# Altium schematic sheet FPGA_IO.SchDoc
size B
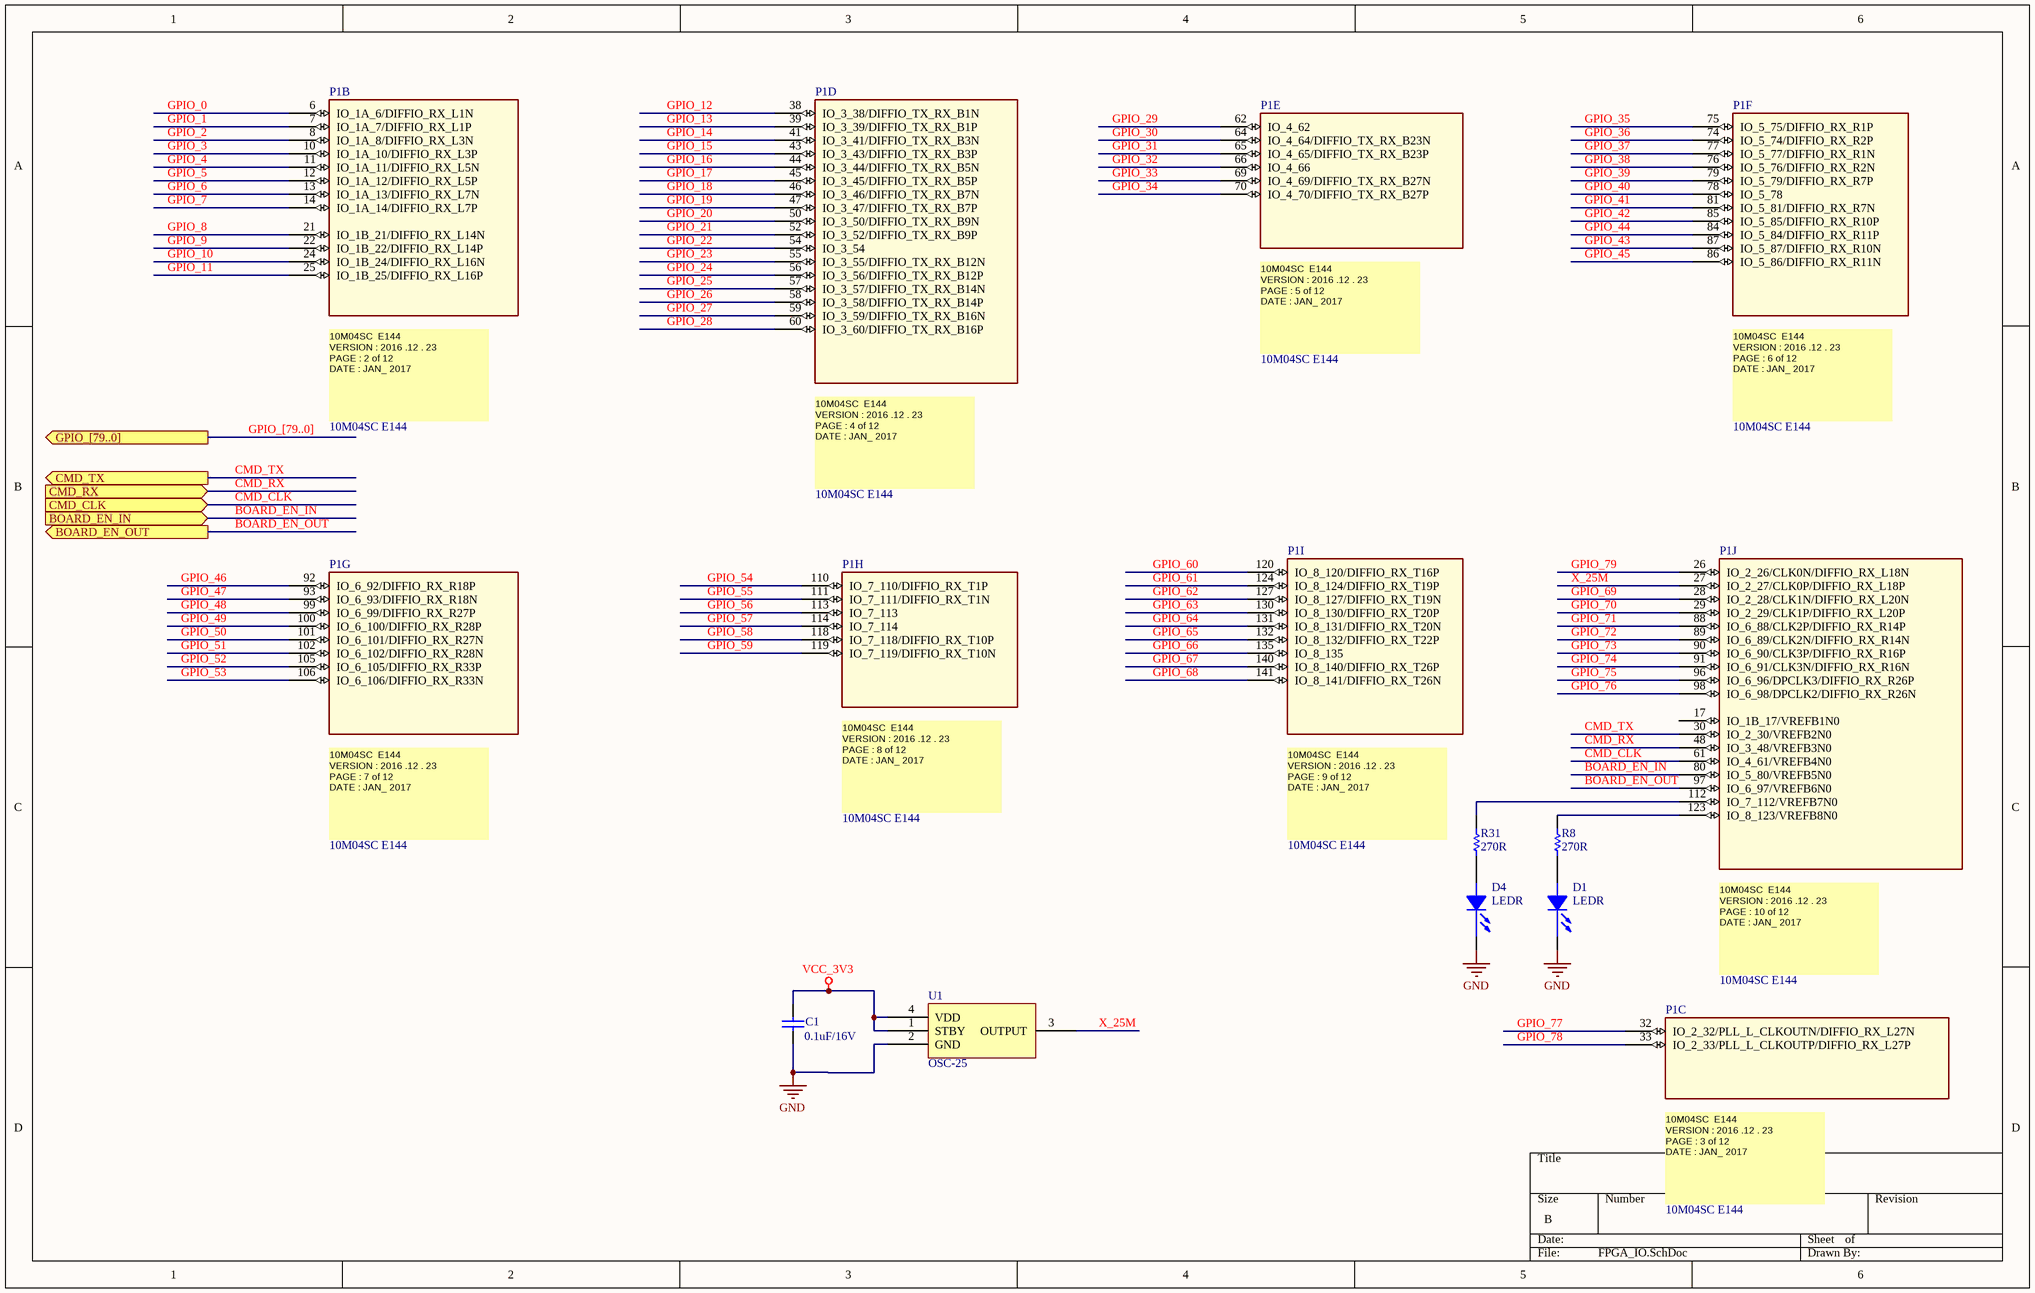
[diagram p0: FPGA_IO.SchDoc]

## Parts
C1  0.1uF/16V  [0402_CAP]
D1  LEDR  [LED0603]
D4  LEDR  [LED0603]
P1  10M04SC E144  (parts B,C,D,E,F,G,H,I,J of 12)
R8  270R  [AXIAL-0.3]
R31  270R  [AXIAL-0.3]
U1  OSC-25  [ASE-25.000MHZ-LC-T]

## Ports
BOARD_EN_IN (in), BOARD_EN_OUT (out), CMD_CLK (in), CMD_RX (in), CMD_TX (out), GPIO_[79..0] (out)

## Nets
GND: C1.1 D1.2(CATHODE) D4.2(CATHODE) U1.2(GND)
VCC_3V3: C1.2 U1.1(STBY) U1.4(VDD)
BOARD_EN_IN: P1.80(IO_5_80/VREFB5N0) ; port BOARD_EN_IN
BOARD_EN_OUT: P1.97(IO_6_97/VREFB6N0) ; port BOARD_EN_OUT
CMD_CLK: P1.61(IO_4_61/VREFB4N0) ; port CMD_CLK
CMD_RX: P1.48(IO_3_48/VREFB3N0) ; port CMD_RX
CMD_TX: P1.30(IO_2_30/VREFB2N0) ; port CMD_TX
GPIO_0: P1.6(IO_1A_6/DIFFIO_RX_L1N)
GPIO_1: P1.7(IO_1A_7/DIFFIO_RX_L1P)
GPIO_2: P1.8(IO_1A_8/DIFFIO_RX_L3N)
GPIO_3: P1.10(IO_1A_10/DIFFIO_RX_L3P)
GPIO_4: P1.11(IO_1A_11/DIFFIO_RX_L5N)
GPIO_5: P1.12(IO_1A_12/DIFFIO_RX_L5P)
GPIO_6: P1.13(IO_1A_13/DIFFIO_RX_L7N)
GPIO_7: P1.14(IO_1A_14/DIFFIO_RX_L7P)
GPIO_8: P1.21(IO_1B_21/DIFFIO_RX_L14N)
GPIO_9: P1.22(IO_1B_22/DIFFIO_RX_L14P)
GPIO_10: P1.24(IO_1B_24/DIFFIO_RX_L16N)
GPIO_11: P1.25(IO_1B_25/DIFFIO_RX_L16P)
GPIO_12: P1.38(IO_3_38/DIFFIO_TX_RX_B1N)
GPIO_13: P1.39(IO_3_39/DIFFIO_TX_RX_B1P)
GPIO_14: P1.41(IO_3_41/DIFFIO_TX_RX_B3N)
GPIO_15: P1.43(IO_3_43/DIFFIO_TX_RX_B3P)
GPIO_16: P1.44(IO_3_44/DIFFIO_TX_RX_B5N)
GPIO_17: P1.45(IO_3_45/DIFFIO_TX_RX_B5P)
GPIO_18: P1.46(IO_3_46/DIFFIO_TX_RX_B7N)
GPIO_19: P1.47(IO_3_47/DIFFIO_TX_RX_B7P)
GPIO_20: P1.50(IO_3_50/DIFFIO_TX_RX_B9N)
GPIO_21: P1.52(IO_3_52/DIFFIO_TX_RX_B9P)
GPIO_22: P1.54(IO_3_54)
GPIO_23: P1.55(IO_3_55/DIFFIO_TX_RX_B12N)
GPIO_24: P1.56(IO_3_56/DIFFIO_TX_RX_B12P)
GPIO_25: P1.57(IO_3_57/DIFFIO_TX_RX_B14N)
GPIO_26: P1.58(IO_3_58/DIFFIO_TX_RX_B14P)
GPIO_27: P1.59(IO_3_59/DIFFIO_TX_RX_B16N)
GPIO_28: P1.60(IO_3_60/DIFFIO_TX_RX_B16P)
GPIO_29: P1.62(IO_4_62)
GPIO_30: P1.64(IO_4_64/DIFFIO_TX_RX_B23N)
GPIO_31: P1.65(IO_4_65/DIFFIO_TX_RX_B23P)
GPIO_32: P1.66(IO_4_66)
GPIO_33: P1.69(IO_4_69/DIFFIO_TX_RX_B27N)
GPIO_34: P1.70(IO_4_70/DIFFIO_TX_RX_B27P)
GPIO_35: P1.75(IO_5_75/DIFFIO_RX_R1P)
GPIO_36: P1.74(IO_5_74/DIFFIO_RX_R2P)
GPIO_37: P1.77(IO_5_77/DIFFIO_RX_R1N)
GPIO_38: P1.76(IO_5_76/DIFFIO_RX_R2N)
GPIO_39: P1.79(IO_5_79/DIFFIO_RX_R7P)
GPIO_40: P1.78(IO_5_78)
GPIO_41: P1.81(IO_5_81/DIFFIO_RX_R7N)
GPIO_42: P1.85(IO_5_85/DIFFIO_RX_R10P)
GPIO_43: P1.87(IO_5_87/DIFFIO_RX_R10N)
GPIO_44: P1.84(IO_5_84/DIFFIO_RX_R11P)
GPIO_45: P1.86(IO_5_86/DIFFIO_RX_R11N)
GPIO_46: P1.92(IO_6_92/DIFFIO_RX_R18P)
GPIO_47: P1.93(IO_6_93/DIFFIO_RX_R18N)
GPIO_48: P1.99(IO_6_99/DIFFIO_RX_R27P)
GPIO_49: P1.100(IO_6_100/DIFFIO_RX_R28P)
GPIO_50: P1.101(IO_6_101/DIFFIO_RX_R27N)
GPIO_51: P1.102(IO_6_102/DIFFIO_RX_R28N)
GPIO_52: P1.105(IO_6_105/DIFFIO_RX_R33P)
GPIO_53: P1.106(IO_6_106/DIFFIO_RX_R33N)
GPIO_54: P1.110(IO_7_110/DIFFIO_RX_T1P)
GPIO_55: P1.111(IO_7_111/DIFFIO_RX_T1N)
GPIO_56: P1.113(IO_7_113)
GPIO_57: P1.114(IO_7_114)
GPIO_58: P1.118(IO_7_118/DIFFIO_RX_T10P)
GPIO_59: P1.119(IO_7_119/DIFFIO_RX_T10N)
GPIO_60: P1.120(IO_8_120/DIFFIO_RX_T16P)
GPIO_61: P1.124(IO_8_124/DIFFIO_RX_T19P)
GPIO_62: P1.127(IO_8_127/DIFFIO_RX_T19N)
GPIO_63: P1.130(IO_8_130/DIFFIO_RX_T20P)
GPIO_64: P1.131(IO_8_131/DIFFIO_RX_T20N)
GPIO_65: P1.132(IO_8_132/DIFFIO_RX_T22P)
GPIO_66: P1.135(IO_8_135)
GPIO_67: P1.140(IO_8_140/DIFFIO_RX_T26P)
GPIO_68: P1.141(IO_8_141/DIFFIO_RX_T26N)
GPIO_69: P1.28(IO_2_28/CLK1N/DIFFIO_RX_L20N)
GPIO_70: P1.29(IO_2_29/CLK1P/DIFFIO_RX_L20P)
GPIO_71: P1.88(IO_6_88/CLK2P/DIFFIO_RX_R14P)
GPIO_72: P1.89(IO_6_89/CLK2N/DIFFIO_RX_R14N)
GPIO_73: P1.90(IO_6_90/CLK3P/DIFFIO_RX_R16P)
GPIO_74: P1.91(IO_6_91/CLK3N/DIFFIO_RX_R16N)
GPIO_75: P1.96(IO_6_96/DPCLK3/DIFFIO_RX_R26P)
GPIO_76: P1.98(IO_6_98/DPCLK2/DIFFIO_RX_R26N)
GPIO_77: P1.32(IO_2_32/PLL_L_CLKOUTN/DIFFIO_RX_L27N)
GPIO_78: P1.33(IO_2_33/PLL_L_CLKOUTP/DIFFIO_RX_L27P)
GPIO_79: P1.26(IO_2_26/CLK0N/DIFFIO_RX_L18N)
X_25M: P1.27(IO_2_27/CLK0P/DIFFIO_RX_L18P) U1.3(OUTPUT)
NetD1_1: D1.1(ANODE) R8.1
NetD4_1: D4.1(ANODE) R31.1
NetP1_112: P1.112(IO_7_112/VREFB7N0) R31.2
NetP1_123: P1.123(IO_8_123/VREFB8N0) R8.2

Not connected (* = marked no-connect by the designer): P1 17(IO_1B_17/VREFB1N0)

## Buses and harness runs
bus GPIO_[79..0] = port GPIO_[79..0]

## Notes on the sheet
- (in symbol 10M04SC E144, part B) 10M04SC  E144 / VERSION : 2016 .12 . 23 / PAGE : 2 of 12 / DATE : JAN_ 2017 /
- (in symbol 10M04SC E144, part C) 10M04SC  E144 / VERSION : 2016 .12 . 23 / PAGE : 3 of 12 / DATE : JAN_ 2017 /
- (in symbol 10M04SC E144, part D) 10M04SC  E144 / VERSION : 2016 .12 . 23 / PAGE : 4 of 12 / DATE : JAN_ 2017 /
- (in symbol 10M04SC E144, part E) 10M04SC  E144 / VERSION : 2016 .12 . 23 / PAGE : 5 of 12 / DATE : JAN_ 2017 /
- (in symbol 10M04SC E144, part F) 10M04SC  E144 / VERSION : 2016 .12 . 23 / PAGE : 6 of 12 / DATE : JAN_ 2017 /
- (in symbol 10M04SC E144, part G) 10M04SC  E144 / VERSION : 2016 .12 . 23 / PAGE : 7 of 12 / DATE : JAN_ 2017 /
- (in symbol 10M04SC E144, part H) 10M04SC  E144 / VERSION : 2016 .12 . 23 / PAGE : 8 of 12 / DATE : JAN_ 2017 /
- (in symbol 10M04SC E144, part I) 10M04SC  E144 / VERSION : 2016 .12 . 23 / PAGE : 9 of 12 / DATE : JAN_ 2017 /
- (in symbol 10M04SC E144, part J) 10M04SC  E144 / VERSION : 2016 .12 . 23 / PAGE : 10 of 12 / DATE : JAN_ 2017 /

## Library data of the parts
C1 = Cap: Multilayer Ceramic Capacitors MLCC - SMD/SMT 10% AEC-Q200 16V 0.1uF X7R 0402; Mfr Part No: C0402T104K4RACTU; Manufacturer: KEMET; Value: 0.1uF/16V; Stockiest: MOUSER; Stockiest Part No: 80-C0402T104K4RACTU; Package: 0402; Price: 0.1
D1 D4 = LED: Standard LEDs - SMD Red 631nm 14mcd 5mA; Manufacturer: Lite-On; Mfr Part No: LTST-C193KRKT-5A; Package: 0603; Price: 0.28; Stockiest Part No: 859-LTSTC193KRKT5A; Value: RED; Stockiest: MOUSER
P1 = 10M04SC E144: SPLIT_INST: TRUE; SWAP_INFO: (S1+S2+S3+S4+S5+S6+S7+S8+S9+S10+S11+S12)
R8 R31 = Res1: Resistor; Published: 8-Jun-2000; LatestRevisionDate: 17-Jul-2002; LatestRevisionNote: Re-released for DXP Platform.; PackageReference: AXIAL-0.3; Publisher: Altium Limited; PackageDescription: Axial Device, Thru-Hole; 2 Leads; 0.3 in Pin Spacing; Value: 270R
U1 = CRYSTAL: Standard Clock Oscillators 25.0 MHZ 3.3V 50PPM SMD 32; Manufacturer: Abracon; Value: 25MHZ; Stockiest: MOUSER; Stockiest Part No: 815-ASE25.000MHZLCT; Mfr Part No: ASE-25.000MHZ-LC-T; Package: SMD; Price: 1.5